# EAGLE design Battery Board v1 (EAGLE 6.5.0)
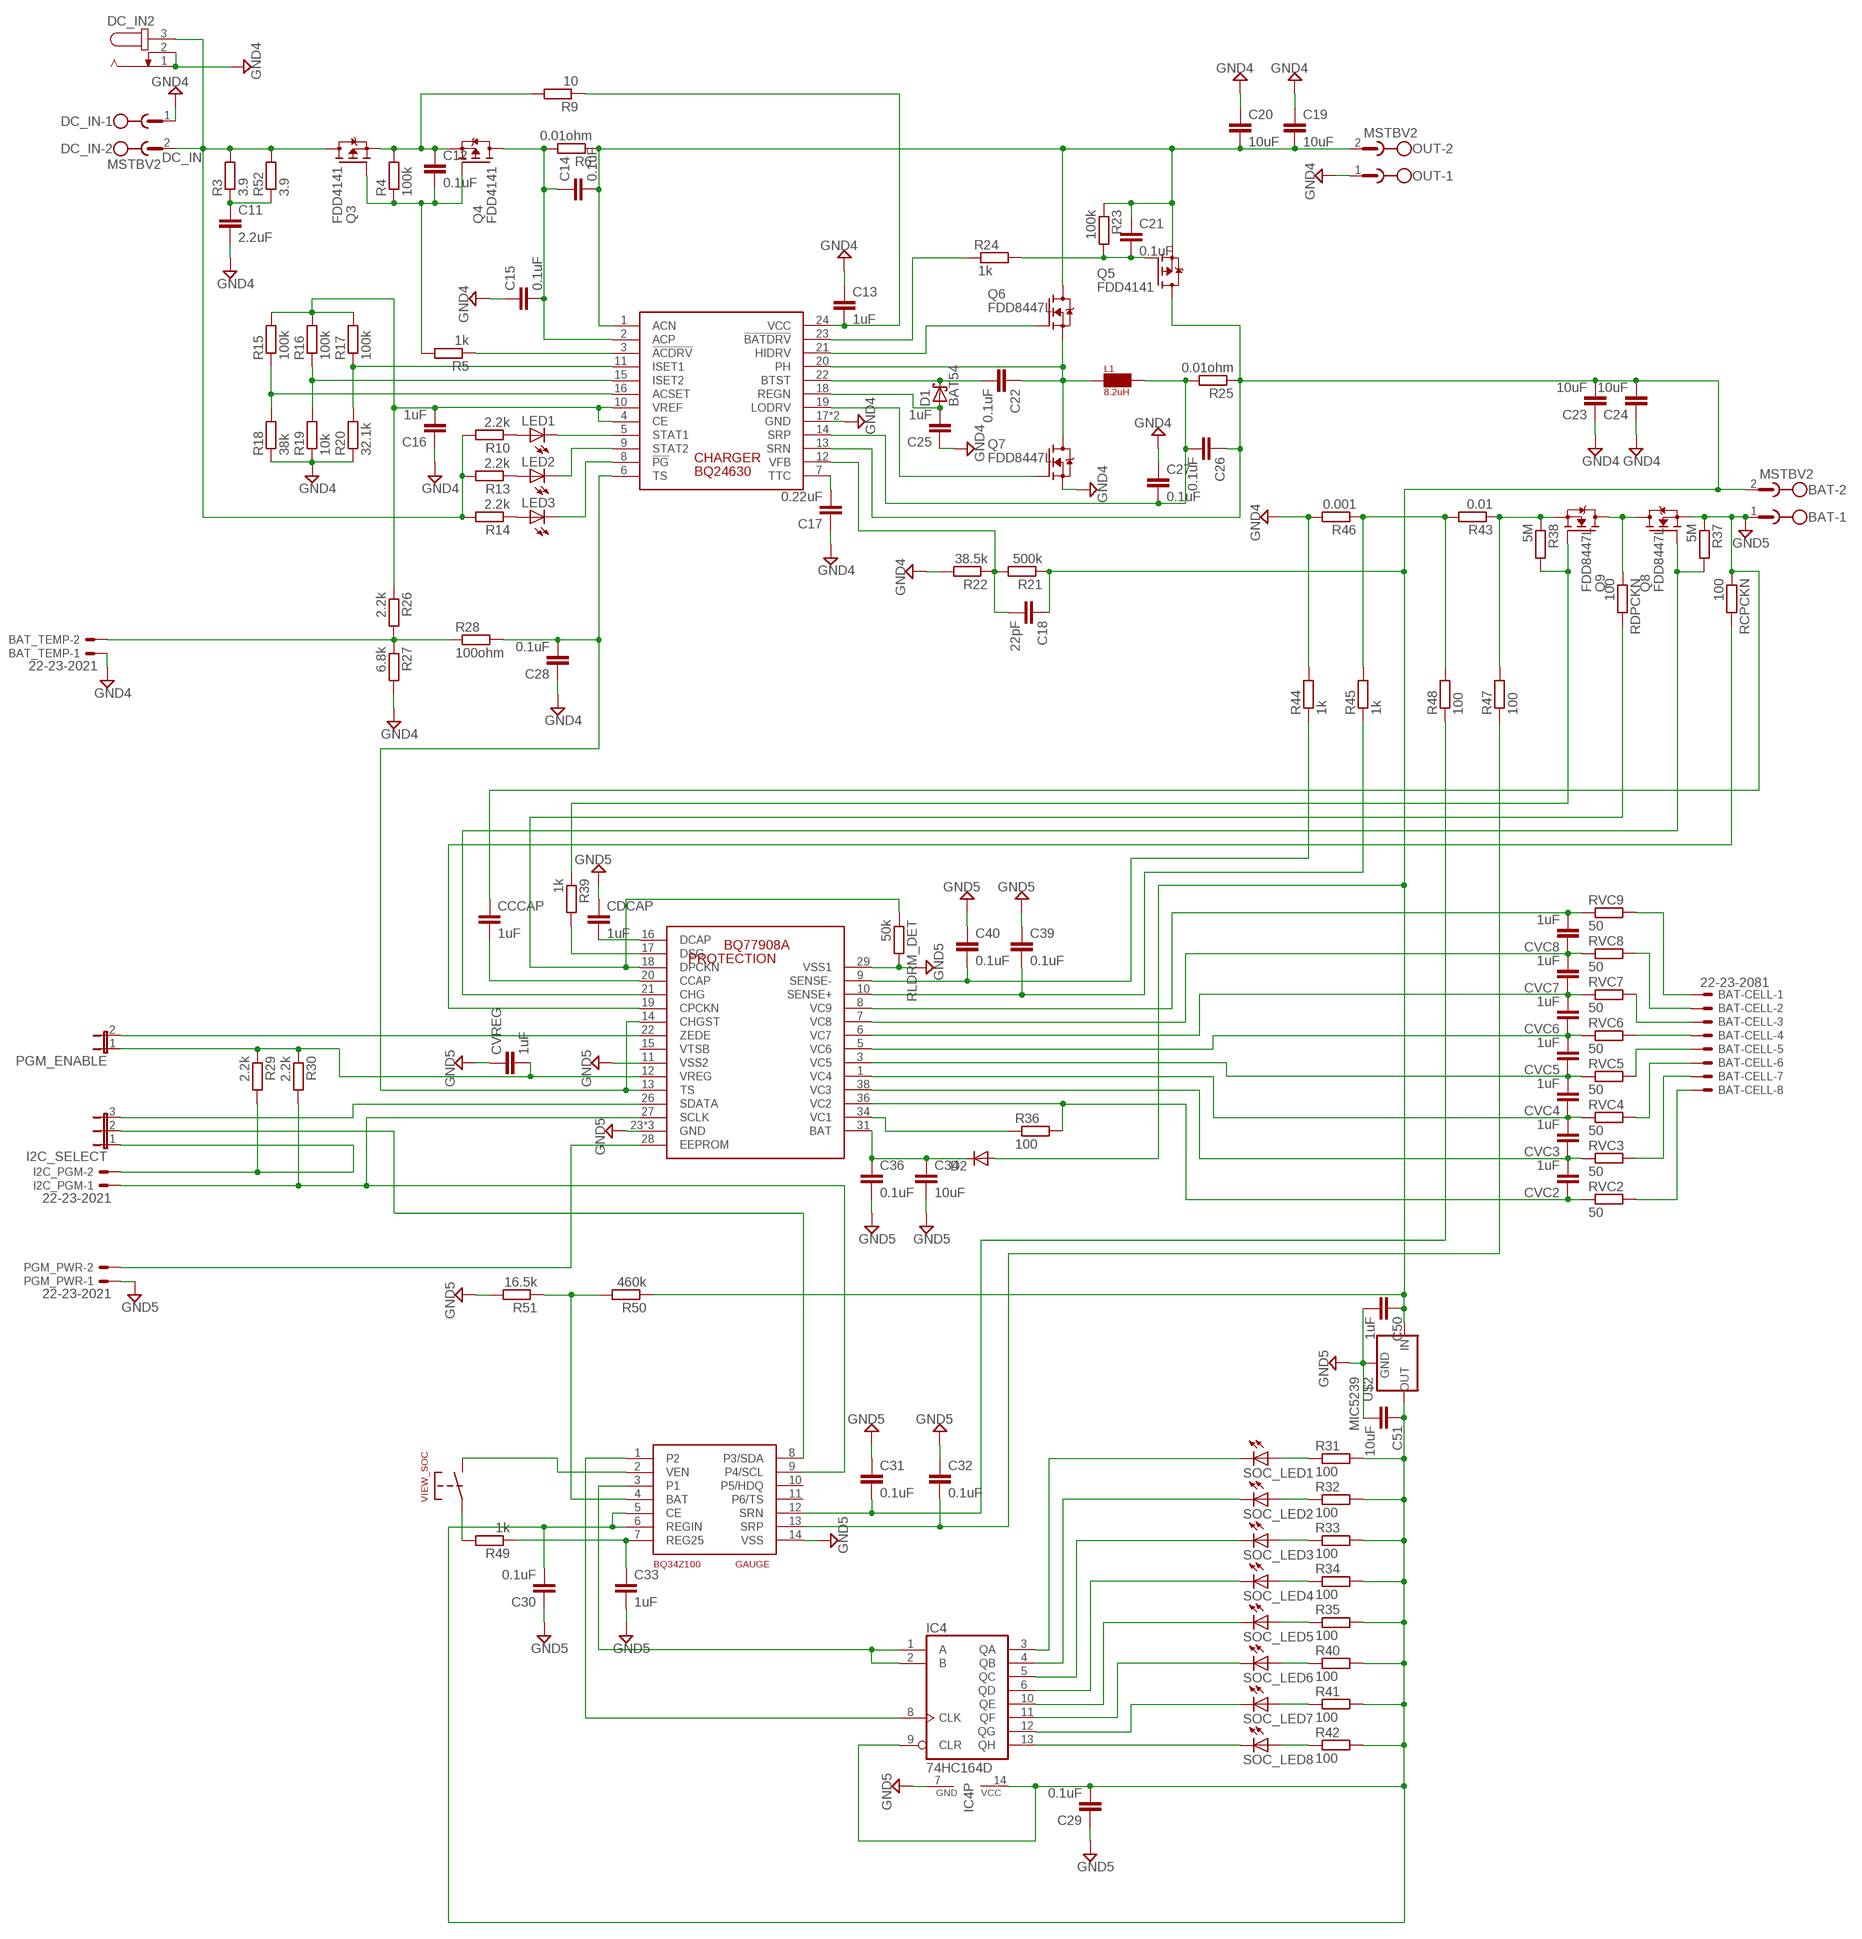
[diagram p0: schematic, sheet 1]

## Parts
BAT  MSTBV2  [MSTBV2]
BAT-CELL  22-23-2081  [22-23-2081]
BAT_TEMP  22-23-2021  [22-23-2021]
C11  2.2uF  C-EUC1206  [C1206]
C12  0.1uF  C-EUC0603  [C0603]
C13  1uF  C-EUC1206  [C1206]
C14  0.1uF  C-EUC0603  [C0603]
C15  0.1uF  C-EUC0603  [C0603]
C16  1uF  C-EUC0805  [C0805]
C17  0.22uF  C-EUC0603  [C0603]
C18  22pF  C-EUC0603  [C0603]
C19  10uF  C-EUC1812  [C1812]
C20  10uF  C-EUC1812  [C1812]
C21  0.1uF  C-EUC0603  [C0603]
C22  0.1uF  C-EUC0603  [C0603]
C23  10uF  C-EUC1812  [C1812]
C24  10uF  C-EUC1812  [C1812]
C25  1uF  C-EUC0805  [C0805]
C26  0.1uF  C-EUC0603  [C0603]
C27  0.1uF  C-EUC0603  [C0603]
C28  0.1uF  C-EUC0603  [C0603]
C29  0.1uF  C-EUC0603  [C0603]
C30  0.1uF  C-EUC0603  [C0603]
C31  0.1uF  C-EUC0603  [C0603]
C32  0.1uF  C-EUC0603  [C0603]
C33  1uF  C-EUC0603  [C0603]
C34  10uF  C-EUC1210  [C1210]
C36  0.1uF  C-EUC1210  [C1210]
C39  0.1uF  C-EUC0603  [C0603]
C40  0.1uF  C-EUC0603  [C0603]
C50  1uF  C-EUC0603  [C0603]
C51  10uF  C-EUC0603  [C0603]
CCCAP  1uF  C-EUC1206  [C1206]
CDCAP  1uF  C-EUC1206  [C1206]
CHARGER  BQ24630  [QFN-24]
CVC2  1uF  C-EUC0603  [C0603]
CVC3  1uF  C-EUC0603  [C0603]
CVC4  1uF  C-EUC0603  [C0603]
CVC5  1uF  C-EUC0603  [C0603]
CVC6  1uF  C-EUC0603  [C0603]
CVC7  1uF  C-EUC0603  [C0603]
CVC8  1uF  C-EUC0603  [C0603]
CVREG  1uF  C-EUC0603  [C0603]
D1  BAT54  [SOT23]
D2  DIODE-SOD123  [SOD123]
DC_IN  MSTBV2  [MSTBV2]
DC_IN2  JACK-PLUG1  [SPC4078]
GAUGE  BQ34Z100  [TSSOP-14-0.65MM]
I2C_PGM  22-23-2021  [22-23-2021]
I2C_SELECT  JP2E  [JP2]
IC4  74HC164D  [SO14]
L1  8.2uH  IHLP-5050CE  [5050CE]
LED1  LEDCHIP-LED0603  [CHIP-LED0603]
LED2  LEDCHIP-LED0603  [CHIP-LED0603]
LED3  LEDCHIP-LED0603  [CHIP-LED0603]
OUT  MSTBV2  [MSTBV2]
PGM_ENABLE  JP1E  [JP1]
PGM_PWR  22-23-2021  [22-23-2021]
PROTECTION  BQ77908A  [TSSOP-38-0.5MM]
Q3  FDD4141  FDD4141TO252  [TO252]
Q4  FDD4141  FDD4141TO252  [TO252]
Q5  FDD4141  FDD4141TO252  [TO252]
Q6  FDD8447L  [TO252]
Q7  FDD8447L  [TO252]
Q8  FDD8447L  [TO252]
Q9  FDD8447L  [TO252]
R3  3.9  R-EU_R1206  [R1206]
R4  100k  R-EU_R0603  [R0603]
R5  1k  R-EU_R0603  [R0603]
R6  0.01ohm  R-EU_R2010  [R2010]
R9  10  R-EU_R1206  [R1206]
R10  2.2k  R-EU_R0603  [R0603]
R13  2.2k  R-EU_R0603  [R0603]
R14  2.2k  R-EU_R0603  [R0603]
R15  100k  R-EU_R0805  [R0805]
R16  100k  R-EU_R0805  [R0805]
R17  100k  R-EU_R0805  [R0805]
R18  38k  R-EU_R0805  [R0805]
R19  10k  R-EU_R0805  [R0805]
R20  32.1k  R-EU_R0805  [R0805]
R21  500k  R-EU_R0805  [R0805]
R22  38.5k  R-EU_R0805  [R0805]
R23  100k  R-EU_R0603  [R0603]
R24  1k  R-EU_R0603  [R0603]
R25  0.01ohm  R-EU_R2010  [R2010]
R26  2.2k  R-EU_R0603  [R0603]
R27  6.8k  R-EU_R0603  [R0603]
R28  100ohm  R-EU_R0603  [R0603]
R29  2.2k  R-EU_R0603  [R0603]
R30  2.2k  R-EU_R0603  [R0603]
R31  100  R-EU_R0603  [R0603]
R32  100  R-EU_R0603  [R0603]
R33  100  R-EU_R0603  [R0603]
R34  100  R-EU_R0603  [R0603]
R35  100  R-EU_R0603  [R0603]
R36  100  R-EU_R0603  [R0603]
R37  5M  R-EU_R0603  [R0603]
R38  5M  R-EU_R0603  [R0603]
R39  1k  R-EU_R0603  [R0603]
R40  100  R-EU_R0603  [R0603]
R41  100  R-EU_R0603  [R0603]
R42  100  R-EU_R0603  [R0603]
R43  0.01  R-EU_R2010  [R2010]
R44  1k  R-EU_R0603  [R0603]
R45  1k  R-EU_R0603  [R0603]
R46  0.001  R-EU_R2010  [R2010]
R47  100  R-EU_R0603  [R0603]
R48  100  R-EU_R0603  [R0603]
R49  1k  R-EU_R0603  [R0603]
R50  460k  R-EU_R0805  [R0805]
R51  16.5k  R-EU_R0603  [R0603]
R52  3.9  R-EU_R1206  [R1206]
RCPCKN  100  R-EU_R0603  [R0603]
RDPCKN  100  R-EU_R0603  [R0603]
RLDRM_DET  50k  R-EU_R0603  [R0603]
RVC2  50  R-EU_R1206  [R1206]
RVC3  50  R-EU_R1206  [R1206]
RVC4  50  R-EU_R1206  [R1206]
RVC5  50  R-EU_R1206  [R1206]
RVC6  50  R-EU_R1206  [R1206]
RVC7  50  R-EU_R1206  [R1206]
RVC8  50  R-EU_R1206  [R1206]
RVC9  50  R-EU_R1206  [R1206]
SOC_LED1  LEDCHIP-LED0603  [CHIP-LED0603]
SOC_LED2  LEDCHIP-LED0603  [CHIP-LED0603]
SOC_LED3  LEDCHIP-LED0603  [CHIP-LED0603]
SOC_LED4  LEDCHIP-LED0603  [CHIP-LED0603]
SOC_LED5  LEDCHIP-LED0603  [CHIP-LED0603]
SOC_LED6  LEDCHIP-LED0603  [CHIP-LED0603]
SOC_LED7  LEDCHIP-LED0603  [CHIP-LED0603]
SOC_LED8  LEDCHIP-LED0603  [CHIP-LED0603]
U$2  MIC5239  [SOT223]
VIEW_SOC  PUSHBUTTON  [PUSHBUTTON]

## Nets
DC_IN: DC_IN2.3 DC_IN.2 Q3.3(D) R3.2 R10.2 R13.2 R14.2 R52.2
GND4: BAT_TEMP.1 C11.2 C13.1 C15.1 C16.1 C17.1 C19.1 C20.1 C23.1 C24.1 C25.1 C27.1 C28.1 CHARGER.17(GND) CHARGER.THERMAL(GND) DC_IN2.1 DC_IN2.2 DC_IN.1 OUT.1 Q7.2(S) R18.1 R19.1 R20.1 R22.2 R27.2 R44.2 R46.2
GND5: BAT.1 C29.1 C30.1 C31.1 C32.1 C33.2 C34.2 C36.2 C39.1 C40.1 C50.2 C51.2 CCCAP.1 CDCAP.1 CVREG.1 GAUGE.14(VSS) IC4.7(GND) PGM_PWR.1 PROTECTION.11(VSS2) PROTECTION.23(GND) PROTECTION.24(GND) PROTECTION.25(GND) PROTECTION.29(VSS1) Q8.2(S) R37.1 R51.2 RCPCKN.1 RLDRM_DET.2 U$2.2(GND) U$2.4(GND)
N$13: C11.1 R3.1 R52.1
N$41: C12.1 Q3.2(S) Q4.2(S) R4.2 R9.2
N$42: C12.2 Q3.1(G) Q4.1(G) R4.1 R5.2
N$43: CHARGER.3(!ACDRV!) R5.1
N$44: C17.2 CHARGER.7(TTC)
N$45: C13.2 CHARGER.24(VCC) R9.1
N$46: C14.2 C19.2 C20.2 C21.1 CHARGER.1(ACN) OUT.2 Q5.2(S) Q6.3(D) R6.1 R23.1
N$47: C18.2 CHARGER.12(VFB) R21.2 R22.1
N$48: CHARGER.5(STAT1) LED1.C
N$49: CHARGER.9(STAT2) LED2.C
N$50: CHARGER.8(!PG!) LED3.C
N$51: LED1.A R10.1
N$52: LED2.A R13.1
N$53: LED3.A R14.1
N$54: BAT_TEMP.2 R26.2 R27.1 R28.1
N$55: CHARGER.16(ACSET) R15.1 R18.2
N$56: CHARGER.15(ISET2) R16.1 R19.2
N$57: CHARGER.11(ISET1) R17.1 R20.2
N$58: Q8.3(D) Q9.3(D) RDPCKN.1
N$59: C28.2 CHARGER.6(TS) PROTECTION.13(TS) PROTECTION.14(CHGST) R28.2
N$60: C21.2 Q5.1(G) R23.2 R24.2
N$61: C32.2 GAUGE.13(SRP) R47.1
N$62: CHARGER.23(!BATDRV!) R24.1
N$63: CHARGER.21(HIDRV) Q6.1(G)
N$64: C22.1 CHARGER.20(PH) L1.P$1 Q6.2(S) Q7.3(D)
N$65: C22.2 CHARGER.22(BTST) D1.3(C)
N$66: C34.1 C36.1 D2.C PROTECTION.31(BAT)
N$67: C26.2 C27.2 CHARGER.14(SRP) L1.P$2 R25.2
N$68: BAT-CELL.8 RVC2.2
N$69: C25.2 CHARGER.18(REGN) D1.1(A)
N$70: CHARGER.19(LODRV) Q7.1(G)
N$71: CVC8.2 PROTECTION.8(VC9) RVC9.1
N$72: CVC2.1 PROTECTION.36(VC2) R36.2 RVC2.1
N$73: CVC4.2 CVC5.1 PROTECTION.3(VC5) RVC5.1
N$74: CVC2.2 CVC3.1 PROTECTION.38(VC3) RVC3.1
N$75: PROTECTION.34(VC1) R36.1
N$76: CVC6.2 CVC7.1 PROTECTION.6(VC7) RVC7.1
N$77: CVC5.2 CVC6.1 PROTECTION.5(VC6) RVC6.1
N$78: CVC3.2 CVC4.1 PROTECTION.1(VC4) RVC4.1
N$79: BAT-CELL.7 RVC3.2
N$80: BAT-CELL.6 RVC4.2
N$81: BAT-CELL.5 RVC5.2
N$82: BAT-CELL.4 RVC6.2
N$83: BAT-CELL.3 RVC7.2
N$84: BAT-CELL.2 RVC8.2
N$85: BAT-CELL.1 RVC9.2
N$86: C33.1 GAUGE.7(REG25) R49.1
N$87: Q9.1(G) R38.2 R39.1
N$88: PROTECTION.21(CHG) Q8.1(G) R37.2
N$89: PROTECTION.17(DSG) R39.2
N$90: CDCAP.2 PROTECTION.16(DCAP)
N$91: CVC7.2 CVC8.1 PROTECTION.7(VC8) RVC8.1
N$92: PROTECTION.18(DPCKN) RDPCKN.2 RLDRM_DET.1
N$93: R31.1 SOC_LED1.A
N$94: PROTECTION.19(CPCKN) RCPCKN.2
N$95: CCCAP.2 PROTECTION.20(CCAP)
N$96: R32.1 SOC_LED2.A
N$97: C39.2 PROTECTION.10(SENSE+) R45.1
N$99: C40.2 PROTECTION.9(SENSE-) R44.1
N$100: GAUGE.9(P4/SCL) I2C_PGM.1 PROTECTION.27(SCLK) R30.2
N$101: I2C_PGM.2 I2C_SELECT.1 R29.2
N$102: R33.1 SOC_LED3.A
N$103: PGM_ENABLE.2 PROTECTION.22(ZEDE)
N$104: PGM_PWR.2 PROTECTION.28(EEPROM)
N$105: C29.2 C30.2 C51.1 GAUGE.5(CE) GAUGE.6(REGIN) IC4.9(CLR) IC4.14(VCC) R31.2 R32.2 R33.2 R34.2 R35.2 R40.2 R41.2 R42.2 U$2.3(OUT)
N$106: R34.1 SOC_LED4.A
N$107: R35.1 SOC_LED5.A
N$108: R40.1 SOC_LED6.A
N$109: R41.1 SOC_LED7.A
N$110: R42.1 SOC_LED8.A
N$111: IC4.13(QH) SOC_LED8.C
N$112: IC4.3(QA) SOC_LED1.C
N$113: IC4.4(QB) SOC_LED2.C
N$114: IC4.5(QC) SOC_LED3.C
N$115: IC4.6(QD) SOC_LED4.C
N$116: IC4.10(QE) SOC_LED5.C
N$118: IC4.12(QG) SOC_LED7.C
N$120: I2C_SELECT.3 PROTECTION.26(SDATA)
N$121: GAUGE.8(P3/SDA) I2C_SELECT.2
N$122: C31.2 GAUGE.12(SRN) R48.1
N$123: GAUGE.3(P1) IC4.1(A) IC4.2(B)
N$124: GAUGE.1(P2) IC4.8(CLK)
N$126: R49.2 VIEW_SOC.P$1 VIEW_SOC.P$2
N$127: GAUGE.2(VEN) VIEW_SOC.P$3 VIEW_SOC.P$4
N$128: GAUGE.4(BAT) R50.2 R51.1
N$129: BAT.2 C18.1 C23.2 C24.2 C26.1 C50.1 CHARGER.13(SRN) D2.A Q5.3(D) R21.1 R25.1 R50.1 U$2.1(IN)
N$130: CVREG.2 PGM_ENABLE.1 PROTECTION.12(VREG) R29.1 R30.1
N$131: R43.2 R45.2 R46.1 R48.2
N$132: Q9.2(S) R38.1 R43.1 R47.2
SI7617DN: C14.1 C15.2 CHARGER.2(ACP) Q4.3(D) R6.2
SOC_LED6: IC4.11(QF) SOC_LED6.C
VREF: C16.2 CHARGER.4(CE) CHARGER.10(VREF) R15.2 R16.2 R17.2 R26.1
Unconnected: GAUGE.10(P5/HDQ) GAUGE.11(P6/TS) PROTECTION.15(VTSB)

## Library data of the parts
BAT DC_IN OUT = con-phoenix-508:MSTBV2: PHOENIX; MPN: MSTBV 2,5/2-GF-5.08; OC_FARNELL: 1792792; OC_NEWARK: 69R9845
BAT-CELL = con-molex:22-23-2081: .100" (2.54mm) Center Header - 8 Pin; MF: MOLEX; MPN: 22-23-2081; OC_FARNELL: 1756826; OC_NEWARK: 01C7592
BAT_TEMP I2C_PGM PGM_PWR = con-molex:22-23-2021: .100" (2.54mm) Center Header - 2 Pin; MF: MOLEX; MPN: 22-23-2021; OC_FARNELL: 1462926; OC_NEWARK: 25C3832
C11-C34 C36 C39 C40 C50 C51 CCCAP CDCAP CVC2-CVC8 CVREG = rcl:C-EU: CAPACITOR, European symbol
CHARGER = custom:BQ24630
D1 = diode:BAT54: Schottky Diodes Source: Fairchild .. BAT54.pdf
D2 = diode:DIODE-: DIODE
DC_IN2 = con-jack:JACK-PLUG: DC POWER JACK Power Jack, DC, Right Angle, Through Hole, Rated 5A at 16VDC, PC Terminals Distributor: Farnell (www.Farnell.de) Drawing: 84N1161.pdf / 84N1162.pdf Manufacturer: SPC Technology (www.spctechnology.com) Type: SPC4077 / SPC 4078; OC_FARNELL: unknown; OC_NEWARK: unknown
GAUGE = custom:BQ34Z100
I2C_SELECT = jumper:JP2E: JUMPER
IC4 = 74xx-eu:74*164: 8-bit parallel out SHIFT REGISTER
L1 = custom:IHLP-5050CE
LED1-LED3 SOC_LED1-SOC_LED8 = led:LED: LED OSRAM: - CHIPLED LG R971, LG N971, LY N971, LG Q971, LY Q971, LO R971, LY R971 LH N974, LH R974 LS Q976, LO Q976, LY Q976 LO Q996 - Hyper CHIPLED LW Q18S LB Q993, LB Q99A, LB R99A - SideLED LS A670, LO A670, LY A670, LG A670, LP A670 LB A673, LV A673, LT A673, LW A673 LH A674 LY A675 LS A676, LA A676, LO A676, LY A676, LW A676 LS A679, LY A679, LG A679 - Hyper Micro SIDELED® LS Y876, LA Y876, LO Y876, LY Y876 LT Y87S - SmartLED LW L88C, LW L88S LB L89C, LB L89S, LG L890 LS L89K, LO L89K, LY L89K LS L896, LA L896, LO L896, LY L896 - TOPLED LS T670, LO T670, LY T670, LG T670, LP T670 LSG T670, LSP T670, LSY T670, LOP T670, LYG T670 LG T671, LOG T671, LSG T671 LB T673, LV T673, LT T673, LW T673 LH T674 LS T676, LA T676, LO T676, LY T676, LB T676, LH T676, LSB T676, LW T676 LB T67C, LV T67C, LT T67C, LS T67K, LO T67K, LY T67K, LW E67C LS E67B, LA E67B, LO E67B, LY E67B, LB E67C, LV E67C, LT E67C LW T67C LS T679, LY T679, LG T679 LS T770, LO T770, LY T770, LG T770, LP T770 LB T773, LV T773, LT T773, LW T773 LH T774 LS E675, LA E675, LY E675, LS T675 LS T776, LA T776, LO T776, LY T776, LB T776 LHGB T686 LT T68C, LB T68C - Hyper Mini TOPLED® LB M676 - Mini TOPLED Santana® LG M470 LS M47K, LO M47K, LY M47K Source: http://www.osram.convergy.de LUXEON: - LUMILED® LXK2-PW12-R00, LXK2-PW12-S00, LXK2-PW14-U00, LXK2-PW14-V00 LXK2-PM12-R00, LXK2-PM12-S00, LXK2-PM14-U00 LXK2-PE12-Q00, LXK2-PE12-R00, LXK2-PE12-S00, LXK2-PE14-T00, LXK2-PE14-U00 LXK2-PB12-K00, LXK2-PB12-L00, LXK2-PB12-M00, LXK2-PB14-N00, LXK2-PB14-P00, LXK2-PB14-Q00 LXK2-PR12-L00, LXK2-PR12-M00, LXK2-PR14-Q00, LXK2-PR14-R00 LXK2-PD12-Q00, LXK2-PD12-R00, LXK2-PD12-S00 LXK2-PH12-R00, LXK2-PH12-S00 LXK2-PL12-P00, LXK2-PL12-Q00, LXK2-PL12-R00 Source: www.luxeon.com KINGBRIGHT: KA-3528ASYC Source: www.kingbright.com
PGM_ENABLE = jumper:JP1E: JUMPER
PROTECTION = custom:BQ77908A
Q3-Q5 = transistor-fet:FDD4141: P-Channel PowerTrench® MOSFET Source: FDD4141.pdf
Q6-Q9 = transistor-fet:FDD8447L
R3-R6 R9 R10 R13-R52 RCPCKN RDPCKN RLDRM_DET RVC2-RVC9 = rcl:R-EU_: RESISTOR, European symbol
U$2 = v-reg:MIC5239
VIEW_SOC = custom:PUSHBUTTON

## Board
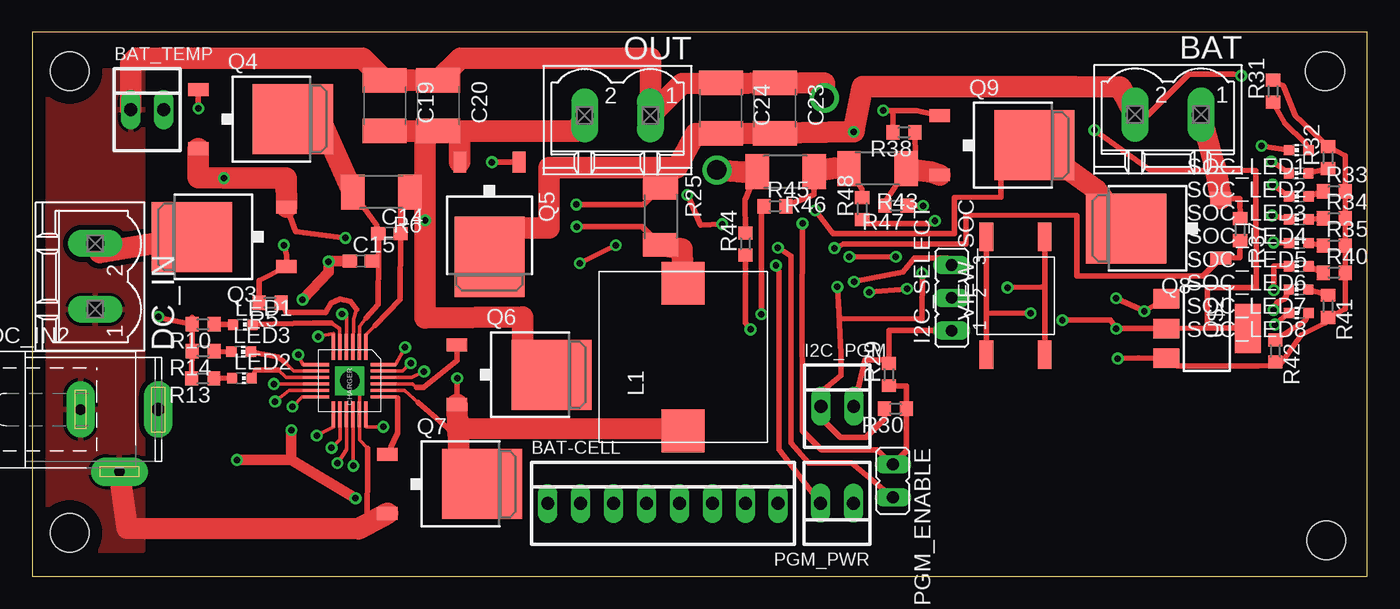
[diagram p1: board, top side]
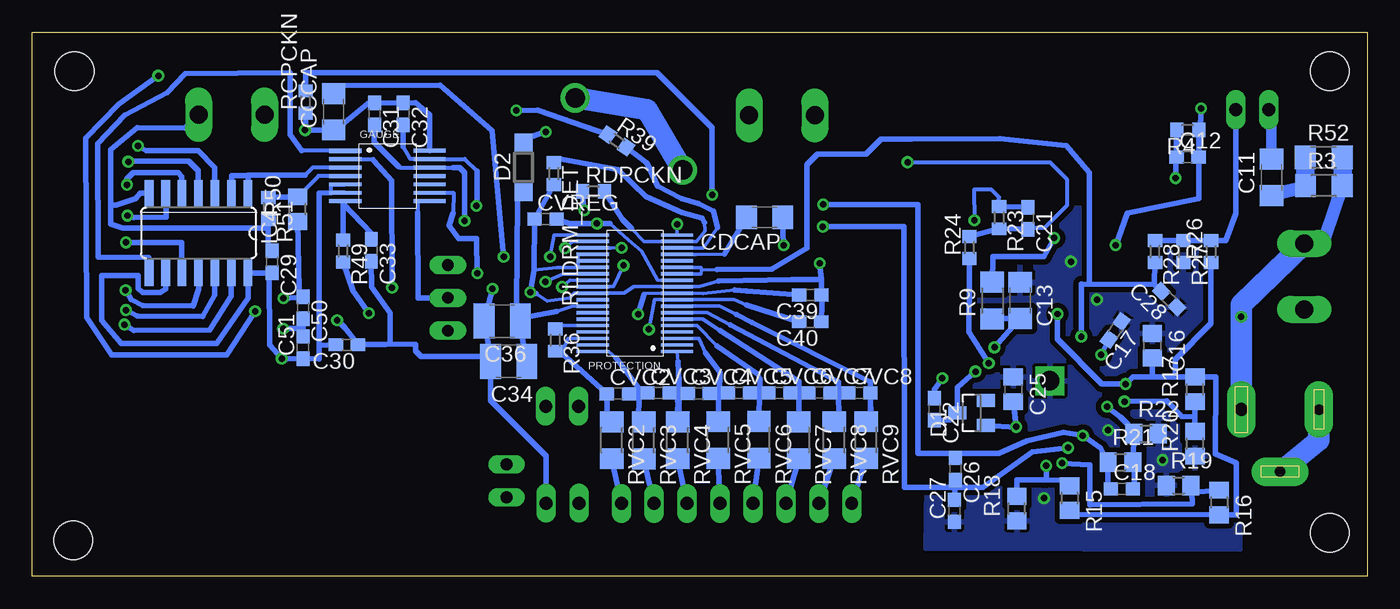
[diagram p2: board, bottom side, seen from below]

Size 103 x 42 mm. Coordinates in mm from the lower left corner, seen from the top.
Outline: 0,0 103,0 103,42 0,42 0,0
Copper layers (1*16): Top 0.035mm / dielectric 1.5mm / Bottom 0.035mm
Design rules "default *": minimum track width 8mil, minimum drill 0.3mm, track to track 8mil, track to pad 8mil, pad to pad 8mil, via to via 8mil, smd to smd 8mil, copper to edge 40mil, drill to drill 8mil, minimum pad ring 10mil, minimum via ring 8mil, stop-mask expansion 4mil, vias tented up to drill 0mil, thermal gap 10mil
Holes 3 mm at 2.89,3.37 2.89,39 99.76,39 99.84,2.78

### Footprints (pad centres in the part's own frame; a part is rotated, then mirrored left to right if it is on the bottom)
MSTBV2 = drill 1.397 long: 1 -2.54,0; 2 2.54,0
22-23-2081 = drill 1 long: 1 -8.89,0; 2 -6.35,0; 3 -3.81,0; 4 -1.27,0; 5 1.27,0; 6 3.81,0; 7 6.35,0; 8 8.89,0
22-23-2021 = drill 1 long: 1 -1.27,0; 2 1.27,0
C1206 = smd 1.6 x 1.8: 1 -1.4,0; 2 1.4,0
C0603 = smd 1.1 x 1: 1 -0.85,0; 2 0.85,0
C0805 = smd 1.3 x 1.5: 1 -0.95,0; 2 0.95,0
C1812 = smd 1.9 x 3.4: 1 -1.95,0; 2 1.95,0
C1210 = smd 1.6 x 2.7: 1 -1.4,0; 2 1.4,0
QFN-24 = smd 2 x 0.25: 1 -2.6,1.25; 2 -2.6,0.75; 3 -2.6,0.25; 4 -2.6,-0.25; 5 -2.6,-0.75; 6 -2.6,-1.25; 13 2.6,-1.25; 14 2.6,-0.75; 15 2.6,-0.25; 16 2.6,0.25; 17 2.6,0.75; 18 2.6,1.25 | smd 0.25 x 2: 7 -1.25,-2.6; 8 -0.75,-2.6; 9 -0.25,-2.6; 10 0.25,-2.6; 11 0.75,-2.6; 12 1.25,-2.6; 19 1.25,2.6; 20 0.75,2.6; 21 0.25,2.6; 22 -0.25,2.6; 23 -0.75,2.6; 24 -1.25,2.6 | drill 1.5 pad 1.93 square: THERMAL 0,0
SOT23 = smd 1 x 1.4: 1 -0.95,-1.1; 2 0.95,-1.1; 3 0,1.1
SOD123 = smd 1.4 x 1.4: A 1.9,0; C -1.9,0
SPC4078 = drill 0.8 pad 2.184 long: 1 -3,0; 2 0,-4.8 | drill 1 pad 2.184 long: 3 3,0
TSSOP-14-0.65MM = smd 2.5 x 0.35: 1 -3.25,1.95 | smd 2.5 x 0.3: 2 -3.25,1.3; 3 -3.25,0.65; 4 -3.25,0; 5 -3.25,-0.65; 6 -3.25,-1.3; 7 -3.25,-1.95; 8 3.25,-1.95; 9 3.25,-1.3; 10 3.25,-0.65; 11 3.25,0; 12 3.25,0.65; 13 3.25,1.3; 14 3.25,1.95
JP2 = drill 0.914 long: 1 -2.54,0; 2 0,0; 3 2.54,0
SO14 = smd 0.66 x 2.032: 1 -3.81,-3.073; 2 -2.54,-3.073; 3 -1.27,-3.073; 4 0,-3.073; 5 1.27,-3.073; 6 2.54,-3.073; 7 3.81,-3.073; 8 3.81,3.073; 9 2.54,3.073; 10 1.27,3.073; 11 0,3.073; 12 -1.27,3.073; 13 -2.54,3.073; 14 -3.81,3.073
5050CE = smd 3.3 x 3.3: P$1 -5.7,0; P$2 5.7,0
CHIP-LED0603 = smd 0.8 x 0.8: A 0,-0.75; C 0,0.75
JP1 = drill 0.914 long: 1 0,-1.27; 2 0,1.27
TSSOP-38-0.5MM = smd 2.5 x 0.25: 1 -3.25,4.65; 2 -3.25,4.15; 3 -3.25,3.65; 4 -3.25,3.15; 5 -3.25,2.65; 6 -3.25,2.15; 7 -3.25,1.65; 8 -3.25,1.15; 9 -3.25,0.65; 10 -3.25,0.15; 11 -3.25,-0.35; 12 -3.25,-0.85; 13 -3.25,-1.35; 14 -3.25,-1.85; 15 -3.25,-2.35; 16 -3.25,-2.85; 17 -3.25,-3.35; 18 -3.25,-3.85; 19 -3.25,-4.35; 20 3.25,-4.35; 21 3.25,-3.85; 22 3.25,-3.35; 23 3.25,-2.85; 24 3.25,-2.35; 25 3.25,-1.85; 26 3.25,-1.35; 27 3.25,-0.85; 28 3.25,-0.35; 29 3.25,0.15; 30 3.25,0.65; 31 3.25,1.15; 32 3.25,1.65; 33 3.25,2.15; 34 3.25,2.65; 35 3.25,3.15; 36 3.25,3.65; 37 3.25,4.15; 38 3.25,4.65
TO252 = smd 1 x 1.6: 1 -2.28,-4.8; 2 2.28,-4.8 | smd 5.4 x 6.2: 3 0,2.5
R1206 = smd 1.6 x 1.803: 1 -1.422,0; 2 1.422,0
R0603 = smd 1 x 1.1: 1 -0.85,0; 2 0.85,0
R2010 = smd 1.8 x 2.7: 1 -2.2,0; 2 2.2,0
R0805 = smd 1.3 x 1.5: 1 -0.95,0; 2 0.95,0
SOT223 = smd 1.5 x 2: 1 -2.3,-3.15; 2 0,-3.15; 3 2.3,-3.15 | smd 3.8 x 2: 4 0,3.15
PUSHBUTTON = smd 2.184 x 1.067: P$1 -4.55,2.25; P$2 4.55,2.25; P$3 -4.55,-2.25; P$4 4.55,-2.25

### Placement (x,y rotation side)
BAT  87.63,35.65 180 top
BAT-CELL  48.66,5.64 0 top
BAT_TEMP  8.86,36.03 0 top
C11  7.39,30.81 90 bottom
C12  13.85,32.38 0 bottom
C13  26.78,21.3 270 bottom
C14  27.56,26.48 0 top
C15  25.34,24.33 0 top
C16  16.57,17.8 270 bottom
C17  19.44,18.98 235 bottom
C18  18.93,6.76 0 bottom
C19  27.2,36.34 270 top
C20  31.32,36.34 270 top
C21  26.18,27.65 270 bottom
C22  33.4,12.9 270 bottom
C23  57.29,36.15 270 top
C24  53.13,36.14 270 top
C25  27.3,14.44 270 bottom
C26  31.79,8.29 270 bottom
C27  31.85,5.06 90 bottom
C28  15.29,21.41 135 bottom
C29  84.49,24.29 270 bottom
C30  78.73,17.89 180 bottom
C31  76.6,35.71 270 bottom
C32  74.37,35.7 270 bottom
C33  76.84,25.17 270 bottom
C34  66.25,16.61 180 bottom
C36  66.75,19.71 180 bottom
C39  42.97,21.73 180 bottom
C40  42.97,19.66 180 bottom
C50  82.11,20.73 270 bottom
C51  82.12,17.67 90 bottom
CCCAP  79.76,35.86 90 bottom
CDCAP  46.5,27.72 180 bottom
CHARGER  24.48,15.1 270 top
CVC2  57.81,14.1 0 bottom
CVC3  54.67,14.15 0 bottom
CVC4  51.57,14.11 0 bottom
CVC5  48.46,14.16 0 bottom
CVC6  45.35,14.17 0 bottom
CVC7  42.25,14.18 0 bottom
CVC8  39.17,14.15 0 bottom
CVREG  63.4,27.57 0 bottom
D1  30.52,12.62 90 bottom
D2  65.09,31.59 90 bottom
DC_IN  4.85,23.16 90 top
DC_IN2  6.71,12.88 0 top
GAUGE  75.6,30.92 0 bottom
I2C_PGM  62.11,13.13 0 top
I2C_SELECT  70.94,21.51 90 top
IC4  90.18,26.51 180 bottom
L1  50.21,16.93 90 top
LED1  16.25,19.44 270 top
LED2  16.17,15.3 270 top
LED3  16.11,17.34 270 top
OUT  45.15,35.59 180 top
PGM_ENABLE  66.41,7.38 180 top
PGM_PWR  62.08,5.64 180 top
PROTECTION  56.5,22.01 180 bottom
Q3  14.81,26.22 90 top
Q4  17.61,35.31 270 top
Q5  35.27,27.18 180 top
Q6  37.56,15.57 270 top
Q7  32.2,7.13 270 top
Q8  86.91,26.87 90 top
Q9  74.82,33.28 270 top
R3  3.34,30.17 0 bottom
R4  13.85,34.48 180 bottom
R5  18.34,21.13 180 top
R6  26.92,29.67 180 top
R9  28.92,21.3 90 bottom
R10  13.17,19.47 180 top
R13  13.16,15.28 180 top
R14  13.19,17.39 180 top
R15  22.97,6.04 270 bottom
R16  11.43,5.71 270 bottom
R17  13.29,14.44 90 bottom
R18  27.03,5.23 90 bottom
R19  14.55,7.02 0 bottom
R20  13.29,10.23 90 bottom
R21  19.04,8.84 0 bottom
R22  17.06,11 0 bottom
R23  28.4,27.69 270 bottom
R24  30.69,25.39 90 bottom
R25  48.49,27.8 270 top
R26  12.04,25.07 90 bottom
R27  14.18,25.07 270 bottom
R28  16.37,25.09 270 bottom
R29  66.11,15.57 90 top
R30  66.61,12.95 180 top
R31  95.74,37.45 90 top
R32  99.99,32.32 90 top
R33  100.45,29.74 0 top
R34  100.45,27.65 0 top
R35  100.45,25.53 0 top
R36  62.64,18.23 270 bottom
R37  93.2,26.77 270 top
R38  67.27,34.28 180 top
R39  57.89,33.62 325 bottom
R40  100.45,23.43 0 top
R41  99.98,20.85 270 top
R42  95.91,17.41 270 top
R43  65.22,31.48 180 top
R44  55.02,25.67 90 top
R45  57.31,28.58 0 top
R46  58.13,31.24 180 top
R47  66.65,28.63 180 top
R48  64.03,28.39 90 top
R49  79.03,25.12 270 bottom
R50  82.53,28.35 90 bottom
R51  84.79,28.41 270 bottom
R52  3.34,32.34 0 bottom
RCPCKN  81.91,36.63 90 bottom
RDPCKN  59.71,29.72 0 bottom
RLDRM_DET  62.76,31.09 270 bottom
RVC2  58.29,10.51 270 bottom
RVC3  55.83,10.5 270 bottom
RVC4  53.2,10.51 270 bottom
RVC5  50.08,10.53 270 bottom
RVC6  46.93,10.54 270 bottom
RVC7  43.86,10.51 270 bottom
RVC8  41.14,10.52 270 bottom
RVC9  38.67,10.53 270 bottom
SOC_LED1  97.72,32.91 90 top
SOC_LED2  97.71,31.13 90 top
SOC_LED3  97.72,29.34 90 top
SOC_LED4  97.74,27.56 90 top
SOC_LED5  97.73,25.73 90 top
SOC_LED6  97.72,23.94 90 top
SOC_LED7  97.71,22.15 90 top
SOC_LED8  97.72,20.34 90 top
U$2  90.64,19.14 270 top
VIEW_SOC  75.87,21.67 90 top

### Tracks (layer width: path | path; a pad name or v marks a point on that pad's centre or on a via)
DC_IN  (via drill 0.5)
  Top 0.406: R13.2 12.35,17.89 R14.2 12.34,19.98 R10.2 9.76,20 v9.71,20.05
  Top 1.676: DC_IN.2 5.2,24.99 Q3.3
  Bottom 1.016: R3.2 3.25,26.21 DC_IN.2
  Bottom 1.422: R52.2 1.82,30.36 R3.2
  Bottom 1.676: DC_IN.2 9.71,20.98 v9.71,20.05 DC_IN2.3
GND4  (via drill 0.5, 1.5)
  Top 0.254: 25.87,9.9 25.23,10.53 CHARGER.17 25.23,14.35 CHARGER.THERMAL
  Top 0.406: R44.2 55,29.07 R46.2 | 25.87,9.9 25.87,8.05 25.84,4.87 Q7.2
  Top 0.813: v20.85,21.37 22.86,23.51 v22.86,24.3 22.89,24.33 C15.1 | v24.94,6.03 20.06,8.95 v15.78,8.99 19.98,8.99 v19.98,11.29
  Top 1.676: v61.11,36.95 61.13,38.09 C23.1 53.41,38.02 C24.1 50.12,38.05 OUT.1 47.69,40 33.03,40 C20.1 C19.1 25.49,40 8,40 7.59,39.59 BAT_TEMP.1 | v52.82,31.38 54.87,31.2 R46.2 | DC_IN2.2 7.31,3.7 25.16,3.65 Q7.2
  Bottom 0.813: C11.2 7.39,35.83 BAT_TEMP.1
  Bottom 1.676: v61.11,36.95 55.56,36.04 v52.82,31.38 | 3.7,12.91 DC_IN2.1 3.71,10.51 DC_IN2.2
  pour Bottom (isolate 0.406): 9.83,2.08 34.05,2.18 33.62,28.55 10.19,28.26 9.81,5.3
  pour Top (isolate 0.406): 0,2 8.5,2 8.5,39 0,39
GND5  (via drill 0.5)
  Top 0.406: 91.28,31.62 91.36,31.36 94.42,31.35 94.43,22.32 90.67,22.32 90.66,19.18 | 90.66,19.18 U$2.2 83.79,19.13 v83.64,19.13 83.21,19.79 v79.48,19.79 | R37.1 93.18,29.16 Q8.2 | v81.96,34.46 86.33,31.35 91.34,31.33 | 90.66,19.18 93.75,19.18 U$2.4 | v67.49,22.2 v64.58,21.94 | v45.03,25.57 v42.25,24.18
  Top 1.676: BAT.1 91.34,31.33 91.28,31.62 Q8.2
  Bottom 0.254: PROTECTION.23 60.88,24.86 60.88,24.37 PROTECTION.24 60.9,24.35 60.9,23.86 | 60.9,23.86 PROTECTION.25 | 64.13,21.82 63.29,21.26 61.55,21.5 61.19,21.86 PROTECTION.29 57.35,21.86 56.59,22.36 55.18,22.36 PROTECTION.11 51.52,22.36 50.06,22.82 | v64.58,21.94 64.57,22.03 | 64.31,23.64 62.52,23.85 60.9,23.86
  Bottom 0.406: C40.1 42.08,21.1 C39.1 42.12,22.93 | v81.96,34.46 81.93,35.06 RCPCKN.1 81.94,34.46 CCCAP.1 78.9,35.04 77.13,36.49 C31.1 C32.1 73.45,36.56 72.36,35.65 GAUGE.14 | C29.1 84.79,25.44 R51.2 84.79,26.89 96.04,26.9 96.95,27.2 96.95,28.67 | C51.2 82.11,19.14 | 82.11,19.14 C50.2 | C33.2 76.84,22.34 75.38,20.34 75.39,17.93 | 75.39,17.93 75.74,17.91 76.54,17.91 77.6,17.91 C30.1 78.9,19.2 v79.48,19.79 | PGM_PWR.1 63.35,9.3 67.65,13.6 67.65,16.97 | 67.65,16.97 67.65,17.45 C34.2 68.08,19.71 C36.2 v67.49,22.2 | IC4.7 94.68,29.58 95.04,29.17 96.51,28.67 96.95,28.67 | 96.95,28.67 96.95,32.94 94.91,34.65 91.19,34.62 BAT.1 | v83.64,19.13 82.17,19.15 82.11,19.14 | 75.39,17.93 73.44,17.92 73.43,17.4 73,16.97 67.65,16.97 | 64.57,22.03 64.31,23.64 CVREG.1 RLDRM_DET.2 | v64.58,21.94 64.13,21.82 | 50.06,22.82 44.37,22.93 42.12,22.93 | CDCAP.1 v45.03,25.57 | v42.25,24.18 42.12,22.93
N$13
  Bottom 1.016: R3.1 5.05,29.99 6.59,29.62 C11.1
  Bottom 1.422: R52.1 R3.1
N$41  (via drill 0.5)
  Top 0.406: v24.15,26.13 20.31,26.63 Q3.2
  Top 1.676: Q4.2 12.78,30.8 v14.79,30.75 19.59,30.73 Q3.2
  Bottom 0.406: R4.2 14.72,33.1 C12.1 v14.79,30.75 | R9.2 28.89,24.68 24.94,24.68 v24.15,26.13
N$42  (via drill 0.5)
  Top 0.406: v12.81,36.13 12.81,36.96 Q4.1 | v19.42,25.57 19.61,24.75 Q3.1 17.49,22.84 R5.2
  Bottom 0.406: v12.81,36.13 12.84,35.26 R4.1 12.98,33.4 C12.2 12.99,29.16 18.49,28.05 19.41,25.55 v19.42,25.57
N$43
  Top 0.254: CHARGER.3 24.77,19.89 25.03,20.61
  Top 0.406: 25.03,20.61 24.57,21.2 23.76,21.42 23.04,21.11 22.61,20.39 19.57,20.37 R5.1
N$44  (via drill 0.5)
  Top 0.254: CHARGER.7 20.86,16.35 v20.51,17.12
  Bottom 0.406: v20.51,17.12 20.14,17.91 C17.2
N$45  (via drill 0.5)
  Top 0.254: CHARGER.24 28.02,16.35 v28.76,17.68
  Bottom 0.406: v28.76,17.68 v28.75,17.68 C13.2 28.22,19.89 R9.1
N$46  (via drill 0.5)
  Top 0.254: CHARGER.1 25.73,18.67 26.45,19.39
  Top 0.406: R6.1 28.48,29.54 28.4,29.4 C14.2 28.39,21.37 26.45,19.39
  Top 1.676: R6.1 30.31,29.71 30.31,29.83 | 30.31,29.83 v30.3,27.5 30.31,34.48 31.24,34.48 C20.2 | OUT.2 42.05,34.39 32.82,34.39 | Q6.3 37.83,18.03 37.82,20.03 30.31,19.95 30.31,29.83 | 32.82,34.39 C20.2 | C19.2 C20.2 | Q5.2 32.98,34.23 32.82,34.39
  Bottom 0.305: R23.1 28.4,29.27 28.98,29.85 30.34,29.85 v30.3,27.5
  Bottom 0.406: R23.1 C21.1
N$47  (via drill 0.5)
  Top 0.254: CHARGER.12 20.81,13.86 v20.07,13.1
  Bottom 0.406: C18.2 17.97,7.01 17.96,8.17 R21.2 18.03,9.04 R22.1 18.46,11.74 19.05,12.3 19.2,12.44 v20.07,13.1
N$48
  Top 0.254: CHARGER.5 23.72,19.14 23.05,19.55
  Top 0.406: LED1.C 21.69,19.55 23.05,19.55
N$49
  Top 0.254: CHARGER.9 19.57,15.35 18.98,15.94
  Top 0.406: 18.98,15.94 17.22,15.94 LED2.C
N$50
  Top 0.254: CHARGER.8 20.18,15.85 19.53,16.5
  Top 0.406: LED3.C 18.96,16.93 19.53,16.5
N$51
  Top 0.406: R10.1 15.1,19.44 LED1.A
N$52
  Top 0.406: LED2.A 14.11,15.3 R13.1
N$53
  Top 0.406: LED3.A 14.4,17.38 R14.1
N$54
  Bottom 0.406: R28.1 14.26,25.93 R27.1 R26.2 | BAT_TEMP.2 10.12,28.02 10.89,25.91 R26.2 | R26.2
N$55  (via drill 0.5)
  Top 0.254: CHARGER.16 24.73,9.79 v24.76,8.54
  Bottom 0.406: R15.1 22.85,7.43 24.95,7.44 | 24.95,7.44 27.01,7.43 R18.2 | v24.76,8.54 v24.75,8.54 24.75,7.44 24.95,7.44
N$56  (via drill 0.5)
  Top 0.254: CHARGER.15 24.23,9.8 v23.54,8.74
  Bottom 0.406: R16.1 13.54,6.48 | 13.54,6.48 R19.2 | v23.54,8.74 21.39,8.62 21.38,5.54 13.5,5.59 13.54,6.48
N$57  (via drill 0.5)
  Top 0.254: CHARGER.11 19.83,14.35 v18.73,13.5
  Bottom 0.406: R20.2 13.29,12.24 | 13.29,12.24 R17.1 | v18.73,13.5 15.47,13.54 14.31,12.36 13.37,12.32 13.29,12.24
N$58  (via drill 0.5)
  Top 0.406: v60.41,28.26 61.76,26.46 71.15,26.46 71.16,29.26 74.72,29.27 74.72,32.65 77.64,32.65 Q9.3 | 82.31,29.28 82.02,29.89
  Top 1.676: Q8.3 82.02,29.89 Q9.3
  Bottom 0.406: RDPCKN.1 60.49,28.95 v60.41,28.26
N$59  (via drill 0.5)
  Top 0.254: CHARGER.6 23.23,18.74 v22.05,18.51
  Bottom 0.254: PROTECTION.13 51.39,23.36 51.38,23.64 | 51.38,23.64 51.37,23.62 51.41,23.86 PROTECTION.14 | 51.38,23.64 50.16,23.7
  Bottom 0.406: v22.05,18.51 22.06,22.57 22.01,22.55 | 22.01,22.55 16.4,22.57 | 16.4,22.57 R28.2 | 16.4,22.57 16.25,22.34 C28.2 | 50.16,23.7 45.94,23.74 43.22,25.34 43.24,31.81 42.43,32.62 38.69,32.62 37.53,33.78 35.17,33.78 28.35,33.79 23.21,33.26 21.43,31.16 21.43,26.39 21.43,22.56 22.01,22.55
N$60  (via drill 0.5)
  Top 0.406: v35.47,31.98 Q5.1
  Bottom 0.305: v35.47,31.98 24.47,31.98 23.17,30.68 23.17,28.63 24.89,26.91 26.07,26.91 C21.2
  Bottom 0.406: R24.2 R23.2 C21.2
N$61  (via drill 0.5)
  Top 0.406: v68.74,28.62 67.58,28.62 R47.1
  Bottom 0.305: 74.41,33.17 73.85,32.22 GAUGE.13 69.63,32.22 68.7,31.29
  Bottom 0.406: 74.41,33.17 C32.2 | 68.7,31.29 68.7,28.66 v68.74,28.62
N$62  (via drill 0.5)
  Top 0.254: CHARGER.23 28.59,15.85 v29.19,16.46
  Bottom 0.406: v29.19,16.46 30.73,18.89 30.69,23.33 R24.1
N$63
  Top 0.254: CHARGER.21 29.36,14.85 29.63,14.58
  Top 0.406: Q6.1 32.77,16.68 30.17,14.58 29.63,14.58
N$64  (via drill 0.5)
  Top 0.254: CHARGER.20 28.71,14.35 29.75,13.45
  Top 0.406: 29.75,13.45 32.89,10.75 | v32.78,15.3 Q6.2
  Top 1.676: Q7.3 32.88,6.58 32.89,10.75 32.82,11.39 | 32.82,11.39 Q6.2 | L1.P$1 49.63,11.42 32.82,11.39
  Bottom 0.406: C22.1 33.38,14.43 v32.78,15.3
N$65  (via drill 0.5)
  Top 0.254: CHARGER.22 29.27,15.35 v30.22,15.82
  Bottom 0.406: v30.22,15.82 31.62,14.58 D1.3 32.21,12.09 C22.2
N$66
  Bottom 0.254: PROTECTION.31 61.38,20.85 62.55,20.45
  Bottom 0.406: 62.55,20.45 65.23,19.95 65.15,20.03 C36.1 | C36.1 65.24,18.73 C34.1 | C36.1 65.62,21 65.56,29.11 D2.C
N$67  (via drill 0.5)
  Top 0.254: CHARGER.14 23.73,10.57 v23.09,9.93
  Top 0.406: v42,27.01 47.03,27.02 R25.2
  Top 1.676: L1.P$2 50.14,25.26 R25.2
  Bottom 0.406: v23.09,9.93 25.84,9.61 29.65,6.89 31.83,6.88 | 31.83,6.88 35.7,6.89 35.73,26.98 35.76,27.01 v42,27.01 | C27.2 31.82,6.68 C26.2 31.8,6.36 31.83,6.88
N$68
  Bottom 0.406: BAT-CELL.8 RVC2.2
N$69  (via drill 0.5)
  Top 0.254: CHARGER.18 25.73,11.55 v27.08,11.55
  Bottom 0.406: D1.1 27.07,11.51 C25.2 27.1,11.63 v27.08,11.55
N$70
  Top 0.254: CHARGER.19 28.04,13.85 28.19,13.77
  Top 0.406: 28.19,13.77 28.19,11.08 Q7.1
N$71
  Bottom 0.254: PROTECTION.8 49.98,20.87 48.67,20.21
  Bottom 0.406: RVC9.1 38.3,12.05 CVC8.2 38.32,12.76 38.32,15.03 47.48,19.59 48.67,20.21
N$72
  Bottom 0.254: PROTECTION.36 61.65,18.36 62.16,17.27
  Bottom 0.406: RVC2.1 58.61,11.38 CVC2.1 58.68,14.14 62.16,17.27 62.15,17.29 62.86,17.24 R36.2
N$73
  Bottom 0.254: PROTECTION.3 51.56,18.37 51.04,17.27
  Bottom 0.406: CVC4.2 50.07,14.09 49.95,14.13 | 49.95,14.13 CVC5.1 | RVC5.1 50,14.18 | 51.04,17.27 49.95,15.75 49.94,15.44 49.99,14.55 50,14.18 | 50,14.18 49.95,14.13
N$74
  Bottom 0.254: PROTECTION.38 58.53,17.37 57.96,16.86
  Bottom 0.406: CVC2.2 56.25,14.1 56.2,14.5 | 56.2,14.5 CVC3.1 | RVC3.1 56.22,11.49 56.2,14.5 | 57.96,16.86 56.2,14.5
N$75
  Bottom 0.254: PROTECTION.34 62.69,19.36 62.68,19.34
  Bottom 0.406: 62.68,19.34 62.85,19.32 R36.1
N$76
  Bottom 0.254: PROTECTION.6 51.29,19.86 49.92,18.98
  Bottom 0.406: CVC6.2 43.85,14.14 43.82,14.12 | 43.82,14.12 CVC7.1 | RVC7.1 43.86,14.07 43.82,14.12 | 49.92,18.98 43.85,15.05 43.82,14.12
N$77
  Bottom 0.254: PROTECTION.5 51.71,19.36 50.15,17.78
  Bottom 0.406: CVC5.2 46.85,14.19 46.87,14.24 | 46.87,14.24 46.9,14.08 | 46.9,14.08 CVC6.1 | RVC6.1 46.94,12.3 46.9,14.08 | 50.15,17.78 47.05,15.64 46.85,15.25 46.87,14.24
N$78
  Bottom 0.254: PROTECTION.1 53.18,16.6
  Bottom 0.406: CVC3.2 53.14,14.18 53.28,14.21 | 53.28,14.21 CVC4.1 | RVC4.1 53.16,14.21 53.28,14.21 | 53.18,16.6 53.1,15.03 53.1,12.78 53.28,14.21
N$79
  Bottom 0.406: RVC3.2 BAT-CELL.7
N$80
  Bottom 0.406: BAT-CELL.6 RVC4.2
N$81
  Bottom 0.406: BAT-CELL.5 RVC5.2
N$82
  Bottom 0.406: RVC6.2 BAT-CELL.4
N$83
  Bottom 0.406: RVC7.2 BAT-CELL.3
N$84
  Bottom 0.406: RVC8.2 BAT-CELL.2
N$85
  Bottom 0.406: BAT-CELL.1 RVC9.2
N$86
  Bottom 0.305: GAUGE.7 79.04,28.79
  Bottom 0.406: R49.1 79.04,28.79 76.84,26.49 C33.1
N$87  (via drill 0.5)
  Top 0.406: Q9.1 68.23,35.96 v65.65,35.97 66.42,35.96 R38.2
  Bottom 0.406: v65.65,35.97 64.02,35.98 R39.1
N$88  (via drill 0.5)
  Top 0.406: R37.2 93.16,24.6 Q8.1 90.34,23.21 80.62,23.2 80.61,27.87 72.06,27.88 72.06,25.67 62.6,25.67 62.12,25.45 v61.9,25.34
  Bottom 0.254: PROTECTION.21 61.3,25.86 v61.9,25.34
N$89
  Bottom 0.254: PROTECTION.17 51.22,25.36 50.12,26.94
  Bottom 0.406: 50.12,26.94 50.45,28.2 51.59,28.78 52.91,29.17 54.76,30.14 55.58,31.89 R39.2
N$90
  Bottom 0.254: PROTECTION.16 51.81,24.86 51.8,24.87 49.58,24.9
  Bottom 0.406: 49.58,24.9 CDCAP.2
N$91
  Bottom 0.254: PROTECTION.7 50.95,20.36 49.12,19.42
  Bottom 0.406: CVC7.2 40.93,14.13 40.78,14.09 | 40.78,14.09 CVC8.1 | RVC8.1 40.76,12.3 40.78,14.09 | 49.12,19.42 40.8,15 40.78,14.09
N$92
  Bottom 0.254: 51.14,27.32 51.09,26.67 51.75,25.86 PROTECTION.18 55.79,25.86 56.78,26.86
  Bottom 0.406: 51.14,27.32 51.33,27.68 52.87,28.1 55.65,29.33 57.82,31.41 62.19,32.23 RLDRM_DET.1 | RDPCKN.2 57.45,27.56 56.78,26.86
N$93
  Top 0.406: SOC_LED1.A 98.24,33.47 96.64,34.98 R31.1
N$94  (via drill 0.5)
  Top 0.406: v53.23,27.2 51.56,27.12 v50.54,29.47
  Bottom 0.254: PROTECTION.19 53.23,27.18
  Bottom 0.406: 53.23,27.18 v53.23,27.2 | v50.54,29.47 50.54,34.64 54.79,38.89 81.92,38.89 RCPCKN.2
N$95  (via drill 0.5)
  Top 0.406: v63.05,24.68 66.33,24.67 v66.64,24.67
  Bottom 0.254: PROTECTION.20 62.73,26.36 v63.05,24.68
  Bottom 0.406: v66.64,24.67 67.52,34.4 71.54,37.91 79.76,37.88 CCCAP.2
N$96
  Top 0.406: SOC_LED2.A R32.1
N$97  (via drill 0.5)
  Top 0.406: v56.26,20.25 56.26,28.37 R45.1
  Bottom 0.254: 55.79,21.76 55.8,21.86 PROTECTION.10 51.26,21.85 48.81,22.1
  Bottom 0.406: 55.79,21.76 v56.26,20.25 | 48.81,22.1 47.88,22.02 C39.2
N$99  (via drill 0.5)
  Top 0.406: v55.42,19.06 55.03,19.56 R44.1
  Bottom 0.254: v55.42,19.06 54.98,21.37 PROTECTION.9 48.84,21.36 47.88,20.97
  Bottom 0.406: C40.2 46.83,20.62 47.88,20.97
N$100  (via drill 0.5)
  Top 0.406: v62.12,22.35 62.22,21.1 | 62.22,21.1 62.38,17.18 62.39,15.52 60.87,14.26 I2C_PGM.1 60.84,12.25 62.37,10.72 64.31,10.72 65.76,12.17 R30.2 | v68.67,23.4 68.66,19.87 62.26,19.91 62.22,21.1
  Bottom 0.254: PROTECTION.27 61.52,22.88 v62.12,22.35
  Bottom 0.305: GAUGE.9 70.51,29.63 70.52,28.06
  Bottom 0.406: 70.52,28.06 70.86,27.07 70.09,26.08 68.73,26.09 v68.67,23.4
N$101
  Top 0.406: I2C_PGM.2 64.24,16.71 66.11,16.71 | 66.11,16.71 66.1,18.97 I2C_SELECT.1 | R29.2 66.11,16.46 66.11,16.71
N$102
  Top 0.406: SOC_LED3.A R33.1
N$103  (via drill 0.5)
  Top 0.406: PGM_ENABLE.2 63.19,8.76 59.89,8.77 58.53,10.31 58.55,15.47 58.56,24.73 v57.53,25.38
  Bottom 0.254: v57.53,25.38 58.35,25.36 PROTECTION.22
N$104  (via drill 0.5)
  Top 0.406: v57.38,24.01 57.62,23.53 57.59,9.82 PGM_PWR.2
  Bottom 0.254: PROTECTION.28 58.14,22.36 v57.38,24.01
N$105  (via drill 0.5)
  Top 0.406: R31.2 96.54,37.88 97.44,35.58 R32.2 101.3,32.48 R33.2 R34.2 R35.2 R40.2 101.3,20.66 R41.2 99.76,19.55 97.91,18.63 96.31,16.38 R42.2 95.89,16.71 95.9,16.28 94.58,16.25 88.37,16.26 U$2.3 85.36,16.86 v83.76,16.82
  Bottom 0.305: GAUGE.6 79.94,29.62 79.94,30.27 GAUGE.5 | GAUGE.5
  Bottom 0.406: IC4.14 C29.2 | 79.94,29.62 80.88,29.6 80.88,18.77 | 80.88,18.77 80.89,16.8 C51.1 83.36,16.8 v83.76,16.82 84.69,17.88 84.72,23.42 IC4.14 | C30.2 80.89,17.84 80.88,18.77 | IC4.14 86.36,21.48 88.79,17.99 96.16,17.99 97.67,19.74 97.67,22.96 97.67,23.22 94.85,23.23 94.84,22.22 94.48,21.9 93.15,21.9 92.72,22.2 IC4.9
N$106
  Top 0.406: SOC_LED4.A R34.1
N$107
  Top 0.406: SOC_LED5.A R35.1
N$108
  Top 0.406: R40.1 SOC_LED6.A
N$109
  Top 0.406: R41.1 SOC_LED7.A
N$110
  Top 0.406: R42.1 98.24,19.77 SOC_LED8.A
N$111  (via drill 0.5)
  Top 0.406: v95.89,19.44 95.89,19.45 SOC_LED8.C
  Bottom 0.406: IC4.13 87.65,21.65 89.33,19 95.16,18.99 v95.89,19.44
N$112  (via drill 0.5)
  Top 0.406: SOC_LED1.C v94.86,33.22 v94.86,33.23
  Bottom 0.406: v94.86,33.23 94.23,32.86 90.19,32.89 88.92,31.55 IC4.3
N$113  (via drill 0.5)
  Top 0.406: v95.6,32.01 95.76,31.99 SOC_LED2.C
  Bottom 0.406: IC4.4 90.22,31.33 90.95,32.06 95.01,32.06 95.41,32.08 v95.6,32.01
N$114  (via drill 0.5)
  Top 0.406: v95.71,30.25 SOC_LED3.C
  Bottom 0.406: IC4.5 91.47,30.88 91.74,31.16 95.21,31.17 95.71,30.67 v95.71,30.25
N$115  (via drill 0.5)
  Top 0.406: v95.67,27.86 SOC_LED4.C
  Bottom 0.406: IC4.6 92.69,27.72 95.19,27.69 v95.67,27.86
N$116  (via drill 0.5)
  Top 0.406: SOC_LED5.C v95.77,25.78
  Bottom 0.406: v95.77,25.78 91.47,25.78 IC4.10
N$118  (via drill 0.5)
  Top 0.406: SOC_LED7.C 96.64,21.4 96.08,21.18 95.8,20.57 v95.77,20.56
  Bottom 0.406: v95.77,20.56 94.91,20.09 89.88,20.07 88.92,21.72 IC4.12
N$120  (via drill 0.5)
  Top 0.406: v63.4,22.75 67.17,23.51 68.06,24.56 70.63,24.56 I2C_SELECT.3
  Bottom 0.254: PROTECTION.26 62.04,23.36 62.61,23.12 v63.4,22.75
N$121
  Bottom 0.305: GAUGE.8 73.26,28.96 73.26,28.1
  Bottom 0.406: 73.26,28.1 73.23,21.5 I2C_SELECT.2
N$122  (via drill 0.5)
  Top 0.406: R48.1 63.99,27.24 69.54,27.25 v69.65,27.45
  Bottom 0.305: 70.53,31.57 GAUGE.12 74.68,31.57 74.75,31.64
  Bottom 0.406: 70.53,31.57 70.03,31.57 69.64,31.18 v69.65,27.45 | C31.2 76.64,33.52 74.75,31.64
N$123
  Bottom 0.305: GAUGE.3 81.36,31.57 81.96,30.97
  Bottom 0.406: IC4.2 87.64,30.96 86.36,30.96 | 86.36,30.96 IC4.1 | 81.96,30.97 86.35,30.97 86.36,30.96
N$124
  Bottom 0.305: GAUGE.1 82.22,32.87 82.23,32.88
  Bottom 0.406: 82.23,32.88 83.11,34.1 83.12,38.88 91.21,38.83 92.61,37.34 95.89,35.6 97.95,33.4 97.94,24.64 94.03,24.63 94.03,23.43 IC4.8
N$126  (via drill 0.5)
  Top 0.406: 73.64,20.32 VIEW_SOC.P$1 | v77.03,20.31 73.64,20.32 | 73.64,20.32 VIEW_SOC.P$2
  Bottom 0.406: R49.2 78.23,22.02 v77.03,20.31
N$127  (via drill 0.5)
  Top 0.406: v75.25,22.3 77.91,22.33 78.04,22.32 78.12,22.48 | VIEW_SOC.P$4 78.12,24.37 78.12,22.48 | 78.12,22.48 78.14,18.85 VIEW_SOC.P$3
  Bottom 0.305: GAUGE.2 76.69,32.22 75.27,30.55
  Bottom 0.406: 76.64,32.08 75.27,30.55 v75.25,22.3
N$128
  Bottom 0.305: GAUGE.4 80.91,30.92 R50.2
  Bottom 0.406: R50.2 84.75,29.3 R51.1
N$129  (via drill 0.5)
  Top 0.254: CHARGER.13 23.23,11.55 v21.94,10.87
  Top 0.406: v41.97,28.71 47.17,28.72 R25.1 | v63.38,34.33 63.4,34.23 63.49,34.93 | v83.63,21.46 v85.81,20.47 U$2.1 | BAT.2 86.09,35.62 89.24,38.78 92.69,38.76 v93.29,38.65
  Top 1.676: BAT.2 83.96,37.76 83.78,37.77 83.86,37.76 83.56,37.77 80.44,37.8 78.02,37.79 64.05,37.82 63.49,34.93 v63.38,34.33 C23.2 C24.2 51.16,34.17 49.73,31.54 48.48,31.56 | 48.48,31.56 R25.1 | Q5.3 37.32,26.88 39.86,26.91 39.87,31.58 48.48,31.56
  Bottom 0.406: C18.1 20,7.24 R21.1 20.57,9.9 v21.94,10.87 23.43,11.13 26.24,10.46 28.4,9.48 31.72,9.48 | 31.72,9.48 34.65,9.5 34.68,28.71 v41.97,28.71 | D2.A 65.01,33.76 v63.38,34.33 | R50.1 82.41,22.13 C50.1 83.6,21.46 v83.63,21.46 | v93.29,38.65 96.33,36.45 98.89,33.84 98.82,20 96.87,17.11 88.02,17.11 85.85,20.4 v85.81,20.47 | C26.1 31.8,9.11 31.72,9.48
N$130  (via drill 0.5)
  Top 0.406: v59.43,27.25 59.44,24.17 59.37,22.56 59.42,11.25 60.88,9.76 65.18,9.76 PGM_ENABLE.1 67.46,9.7 R30.1 67.46,14.69 R29.1
  Bottom 0.254: PROTECTION.12 54.77,22.87 55.99,25.12 57.01,25.96 58.42,27.25
  Bottom 0.406: 58.42,27.25 v59.43,27.25 61.54,27.25 CVREG.2
N$131
  Top 0.406: R45.2 60.31,29.48 R46.1 | R43.2 64,29.89 R48.2
  Top 1.676: R43.2 61.91,31.51 R46.1
N$132
  Top 0.406: R38.1 68.13,32.35 | 68.13,32.35 R43.1 | 68.13,32.35 65.83,28.99 R47.2
  Top 1.676: Q9.2 69.39,31.22 R43.1
SI7617DN
  Top 0.254: CHARGER.2 25.23,19.3 25.77,19.95
  Top 0.406: 25.77,19.95 26.68,21 26.7,24.78 | 26.7,24.78 C14.1 26.57,27.11 R6.2 | C15.2 26.7,24.33 26.7,24.78
  Top 1.676: Q4.3 20.14,34.94 22.37,34.95 R6.2
SOC_LED6  (via drill 0.5)
  Top 0.406: SOC_LED6.C 95.81,23.96 v95.8,22.09
  Bottom 0.406: v95.8,22.09 95.36,21.38 94.49,20.9 90.59,20.88 90.17,22.2 IC4.11
VREF  (via drill 0.5)
  Top 0.254: CHARGER.10 19.1,14.85 v18.64,14.86 | CHARGER.4 24.23,20.07 v23.9,20.26
  Bottom 0.406: 16.57,15.4 18.09,15.41 v18.64,14.86 v18.65,14.85 20.48,14.85 23.89,18.32 v23.9,20.26 | 16.57,15.4 14.82,15.4 | 14.82,15.4 R17.2 | R17.2 | 16.57,15.4 C16.2 | R15.2 23.36,4.79 R16.2 10.1,4.76 10.08,8.78 11.71,9.46 11.69,15.42 13.27,15.42 R17.2 | R26.1 12.04,19.51 14.79,16.77 14.79,15.43 14.82,15.4